# Altium schematic sheet high_voltage_control.SchDoc
size A4
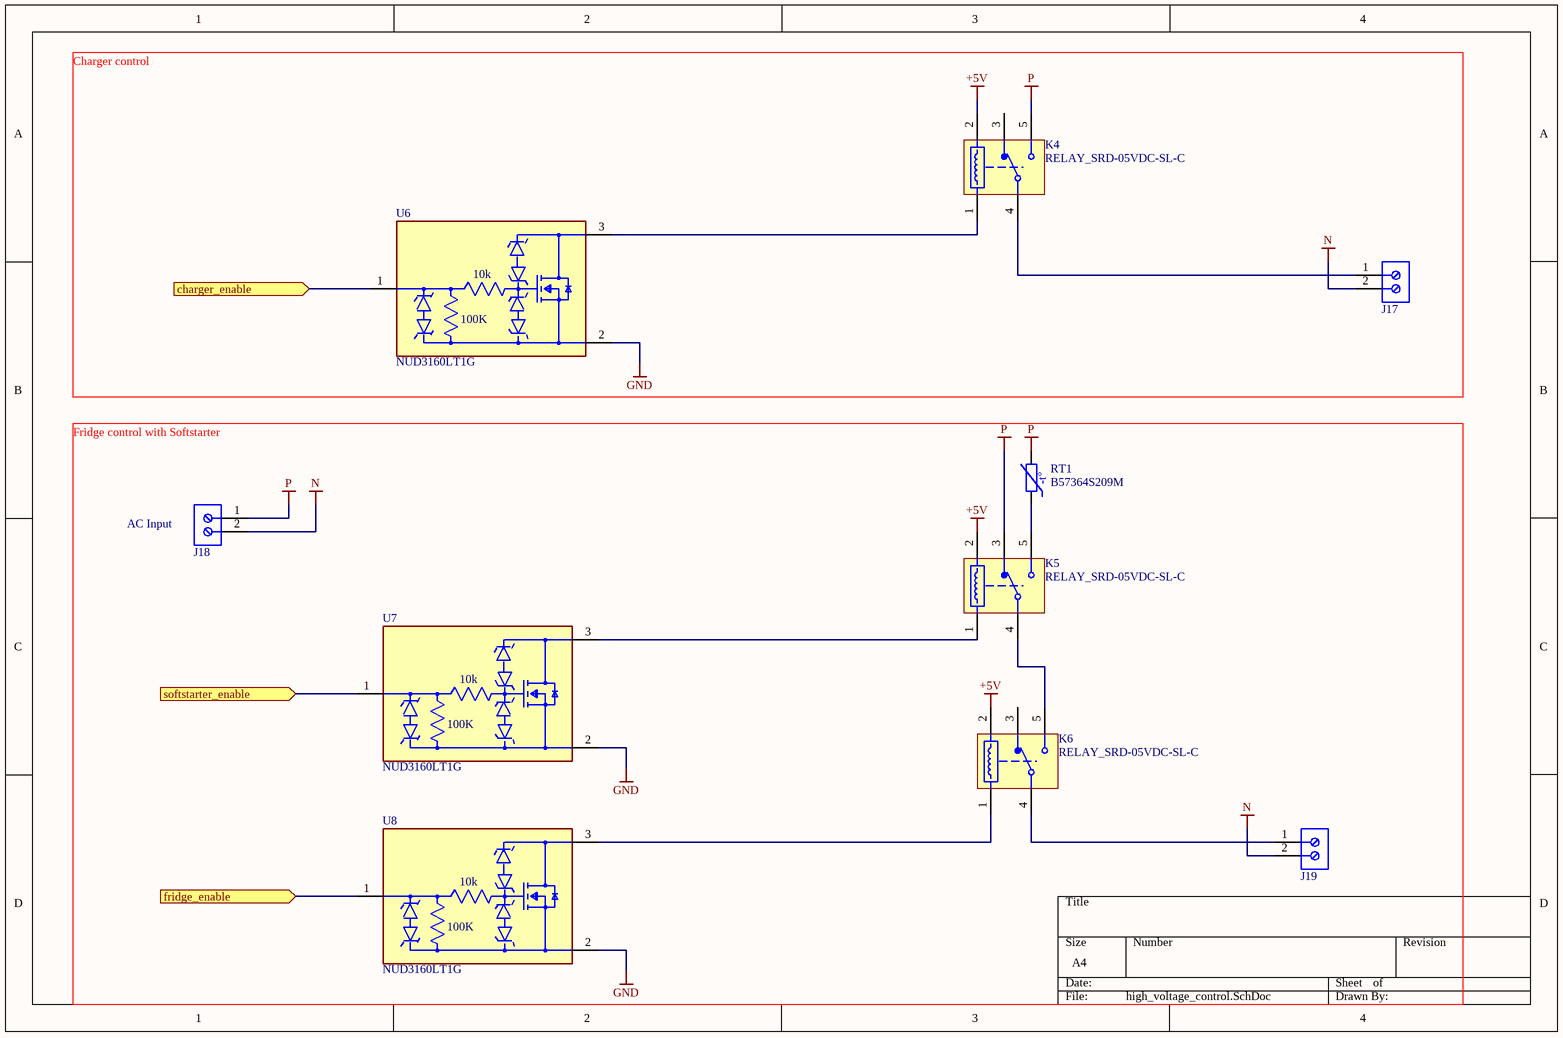
[diagram p0: high_voltage_control.SchDoc]

## Parts
J17  282836-2  [TECO-282836-2_V]  (value not drawn)
J18  282836-2  [TECO-282836-2_V]  (value not drawn)
J19  282836-2  [TECO-282836-2_V]  (value not drawn)
K4  RELAY_SRD-05VDC-SL-C  [SRD-05-VDC-SL-C]
K5  RELAY_SRD-05VDC-SL-C  [SRD-05-VDC-SL-C]
K6  RELAY_SRD-05VDC-SL-C  [SRD-05-VDC-SL-C]
RT1  B57364S209M  [TDK-B57364]
U6  NUD3160LT1G  [FP-318-08-MFG]
U7  NUD3160LT1G  [FP-318-08-MFG]
U8  NUD3160LT1G  [FP-318-08-MFG]

## Ports
charger_enable (in), fridge_enable (in), softstarter_enable (in)

## Nets
+5V: K4.2 K5.2 K6.2
GND: U6.2(Source) U7.2(Source) U8.2(Source)
N: J17.2 J18.2 J19.2
P: J18.1 K4.5(NO) K5.3(NC) RT1.1
charger_enable: U6.1(Gate) ; port charger_enable
fridge_enable: U8.1(Gate) ; port fridge_enable
softstarter_enable: U7.1(Gate) ; port softstarter_enable
NetJ17_1: J17.1 K4.4(COM)
NetJ19_1: J19.1 K6.4(COM)
NetK4_1: K4.1 U6.3(Drain)
NetK5_1: K5.1 U7.3(Drain)
NetK5_4: K5.4(COM) K6.5(NO)
NetK5_5: K5.5(NO) RT1.2
NetK6_1: K6.1 U8.3(Drain)

Not connected (* = marked no-connect by the designer): K4 3(NC); K6 3(NC)

## Notes on the sheet
- Charger control
- (near J18) AC Input
- Fridge control with Softstarter
- (in symbol CMP-2000-05907-1) -t°
- (in symbol CMP-07123-000002-1) 10k; 100K

## Library data of the parts
J17-J19 = CMP-1684-00017-1: Female Header, Pitch 5 mm, 1 x 2 Position, Height 10 mm, Tail Length 3.5 mm, Rohs, Bulk; Manufacturer: TE Connectivity; Wire Gauge: 16-30AWG; Product Training Modules: Wire-to-BoardEurostyleTerminalBlocks; Clamp Material - Plating: Brass-NickelPlated; Voltage: 300V; Mating Orientation: HorizontalwithBoard; Current: 13.5A; Pitch: 0.197"(5.00mm); Screw Thread: M3; 3D Model: 282836-2.pdf; Other Names: 5ULV-02B / A98076; Dynamic Catalog: BuchananSeries; Number of Levels: 1; Torque - Screw: 0.68Nm(6Lb-In); Featured Product: EurostyleTerminalBlockConnectors; Positions Per Level: 2; Wire Termination: Screw-RisingCageClamp; Datasheet URL: http://www.te.com.cn/commerce/DocumentDelivery/DDEController?Action=showdoc&DocId=Catalog+Section%7F1308389_EUROSTYLE_TERMINAL_BLOCKS%7F0607%7Fpdf%7FEnglish%7FENG_CS_1308389_EUROSTYLE_TERMINAL_BLOCKS_0607.pdf%7F282836-2; Color: Green; Family: TerminalBlocks-WiretoBoard; RoHS Information: 282836-2StatementofCompliance; Standard Package: 300; Contact Material - Plating: Brass-TinPlated; Manufacturer URL: http://www.te.com; Housing Material: Polyamide(PA66),Nylon6/6; Features: Interlocking(Side); Package Description: Female Header, Pitch 5 mm, 1 x 2 Position, Height 10 mm, Tail Length 3.5 mm; Mounting Type: ThroughHole; Package Reference: THD; Packaging: Bulk; Series: Buchanan; Category: Connectors,Interconnects; Screw Material - Plating: Brass-NickelPlated
K4-K6 = RELAY_SRD-05VDC-SL-C: 5VDC SPDT Relay; Switching power: 240W; Max. AC current: 3A; Max. DC current: 7A; ca: 7A
RT1 = CMP-2000-05907-1: Inrush Current Limiter, 2 Ohm, -55 to 170 degC, 2-Pin THD, RoHS, Bulk; Manufacturer: TDK; Package Description: 2-Pin Through Hole Device, Body 21 x 7 mm; Package Reference: B57364; Manufacturer URL: http://www.tdk.com/; Datasheet URL: https://en.tdk.eu/inf/50/db/icl_16/S364.pdf; Mounting Technology: ThroughHole; Datasheet Version: 11/2015
U6-U8 = CMP-07123-000002-1: IC INDCT LOAD DRVR INDUST SOT23; Manufacturer: ON Semiconductor; Max Power Dissipation: 225mW; Fall Time: 622ns; Max Supply Voltage: 60V; Propagation Delay: 1160ns; Output Current: 150mA; Output Voltage: 48V; Standoff Height: 0.01mm; Number Of Outputs: 1; Max Junction Temp: +150°C; Rise Time: 600ns; Temperature Range Low: -40°C; Mouser Description: MOSFET 61V Industrial Load Driver; Ambient Temperature Range High: +125°C; Octopart: https://octopart.com/nud3160lt1g-on+semiconductor-470723; Package: 318-08; Automotive: No; Temperature: -40°C to +150°C; RoHS: TRUE; Lead Free: Yes; Height: 1.11mm; Device Class L3: Gate Drivers; Ambient Temperature Range Low: -40°C; Device Class L2: Power Management ICs; Digikey Description: IC INDCT LOAD DRVR INDUST SOT23; Category: IC; Device Class L1: Integrated Circuits (ICs); Manufacturer Part Number: NUD3160LT1G; Footprint Url: https://www.onsemi.com/pub/Collateral/318-08.PDF; Number Of Drivers: 1; ComponentLink2Description: Datasheet; Temperature Range High: +150°C; ComponentLink2URL: https://www.onsemi.com/pub/Collateral/NUD3160-D.PDF